# EAGLE schematic TSF (EAGLE 6.5.0)

## Sheet 1 of 2
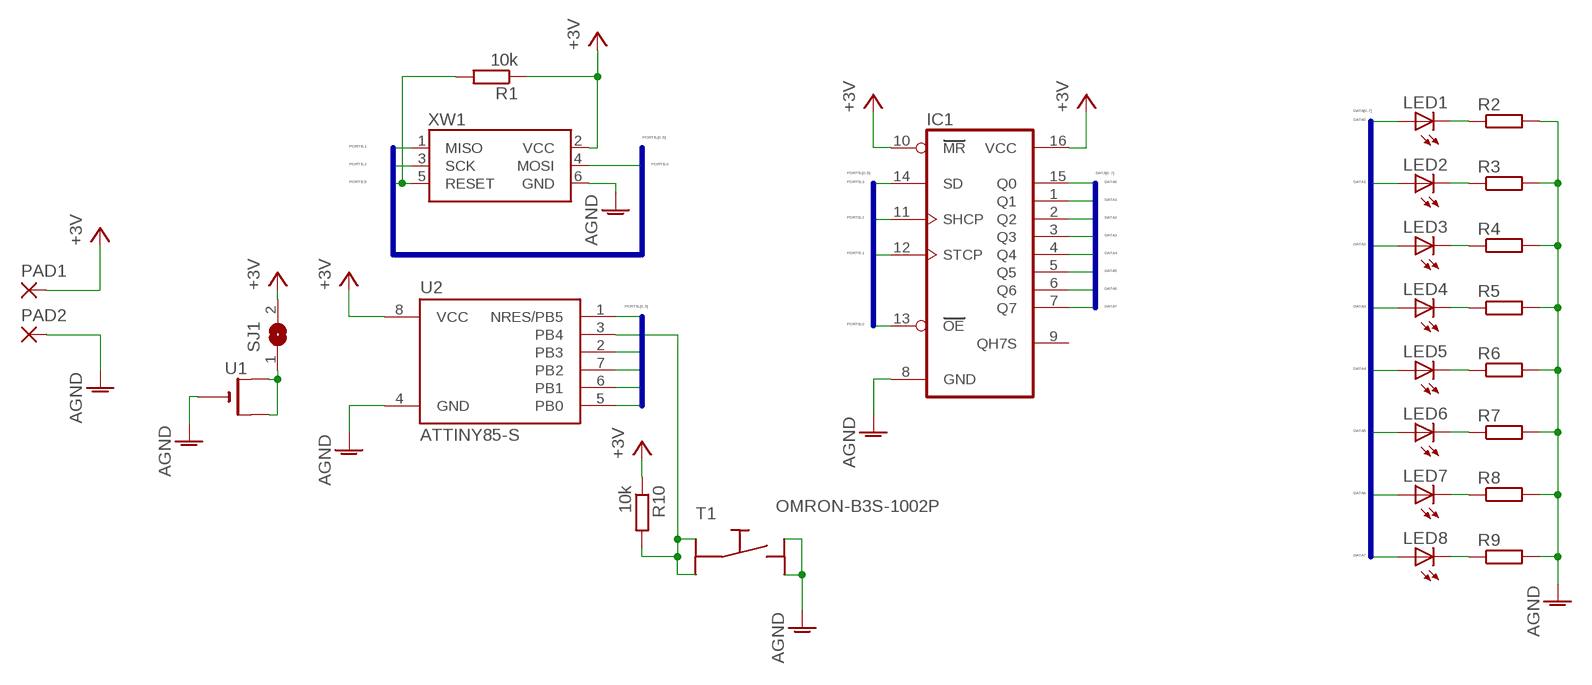
[diagram p0: schematic, sheet 1]

### Parts
IC1  74HC595D  [SO16]
LED1  LEDP-LCC-2  [P-LCC-2]
LED2  LEDP-LCC-2  [P-LCC-2]
LED3  LEDP-LCC-2  [P-LCC-2]
LED4  LEDP-LCC-2  [P-LCC-2]
LED5  LEDP-LCC-2  [P-LCC-2]
LED6  LEDP-LCC-2  [P-LCC-2]
LED7  LEDP-LCC-2  [P-LCC-2]
LED8  LEDP-LCC-2  [P-LCC-2]
PAD1  SMD2  [SMD1,27-2,54]
PAD2  SMD2  [SMD1,27-2,54]
R1  10k  R-EU_R1206  [R1206]
R2  R-EU_M1206  [M1206]
R3  R-EU_M1206  [M1206]
R4  R-EU_M1206  [M1206]
R5  R-EU_M1206  [M1206]
R6  R-EU_M1206  [M1206]
R7  R-EU_M1206  [M1206]
R8  R-EU_M1206  [M1206]
R9  R-EU_M1206  [M1206]
R10  10k  R-EU_R1206  [R1206]
SJ1  SJW  [SJW]
T1  OMRON-B3S-1002P  [B3S-1002P]
U1  CR2032SMT  [CR2032-SMD]
U2  ATTINY85-S  [SOIC8_EIAJ_208MIL]
XW1  WSLSMD  [WSL_SMD]

### Nets
AGND: IC1.8(GND) PAD2.1(P) R2.2 R3.2 R4.2 R5.2 R6.2 R7.2 R8.2 R9.2 T1.3 T1.4 U1.-
DATA0: IC1.15(Q0) LED1.A
DATA1: IC1.1(Q1) LED2.A
DATA2: IC1.2(Q2) LED3.A
DATA3: IC1.3(Q3) LED4.A
DATA4: IC1.4(Q4) LED5.A
DATA5: IC1.5(Q5) LED6.A
DATA6: IC1.6(Q6) LED7.A
DATA7: IC1.7(Q7) LED8.A
GND: XW1.6(GND) ; supply symbol labelled AGND
N$1: SJ1.1 U1.+$1(+) U1.+$2(+1)
N$6: LED1.C R2.1
N$7: LED2.C R3.1
N$8: LED3.C R4.1
N$9: LED4.C R5.1
N$10: LED5.C R6.1
N$11: LED6.C R7.1
N$12: LED7.C R8.1
N$13: LED8.C R9.1
PORTB.0: IC1.13(OE) U2.5(PB0) XW1.4(MOSI)
PORTB.1: IC1.12(STCP) U2.6(PB1) XW1.1(MISO)
PORTB.2: IC1.11(SHCP) U2.7(PB2) XW1.3(SCK)
PORTB.3: IC1.14(SD) U2.2(PB3)
PORTB.4: R10.2 T1.1 T1.2 U2.3(PB4)
PORTB.5: R1.2 U2.1(NRES/PB5) XW1.5(RESET)
VCC: IC1.10(MR) IC1.16(VCC) PAD1.1(P) R1.1 R10.1 SJ1.2 XW1.2(VCC) ; supply symbol labelled +3V
Unconnected: IC1.9(QH7S)

### Buses
PORTB.[0..5]
DATA[0..7]

## Sheet 2 of 2

## Power pins joined to a net without a drawn wire
GND: U2.4(GND)
VCC: U2.8(VCC)

## Library data of the parts
IC1 = 74_er Reihe (DIN Europa):74*595: Name des Bauteiles: 74HC595 Daten: Schieberegister 8 Bit , TTL (5V) Artikelnummer:#045077 Datenblatt:
LED1-LED8 = led:LED: LED OSRAM: - CHIPLED LG R971, LG N971, LY N971, LG Q971, LY Q971, LO R971, LY R971 LH N974, LH R974 LS Q976, LO Q976, LY Q976 LO Q996 - Hyper CHIPLED LW Q18S LB Q993, LB Q99A, LB R99A - SideLED LS A670, LO A670, LY A670, LG A670, LP A670 LB A673, LV A673, LT A673, LW A673 LH A674 LY A675 LS A676, LA A676, LO A676, LY A676, LW A676 LS A679, LY A679, LG A679 - Hyper Micro SIDELED® LS Y876, LA Y876, LO Y876, LY Y876 LT Y87S - SmartLED LW L88C, LW L88S LB L89C, LB L89S, LG L890 LS L89K, LO L89K, LY L89K LS L896, LA L896, LO L896, LY L896 - TOPLED LS T670, LO T670, LY T670, LG T670, LP T670 LSG T670, LSP T670, LSY T670, LOP T670, LYG T670 LG T671, LOG T671, LSG T671 LB T673, LV T673, LT T673, LW T673 LH T674 LS T676, LA T676, LO T676, LY T676, LB T676, LH T676, LSB T676, LW T676 LB T67C, LV T67C, LT T67C, LS T67K, LO T67K, LY T67K, LW E67C LS E67B, LA E67B, LO E67B, LY E67B, LB E67C, LV E67C, LT E67C LW T67C LS T679, LY T679, LG T679 LS T770, LO T770, LY T770, LG T770, LP T770 LB T773, LV T773, LT T773, LW T773 LH T774 LS E675, LA E675, LY E675, LS T675 LS T776, LA T776, LO T776, LY T776, LB T776 LHGB T686 LT T68C, LB T68C - Hyper Mini TOPLED® LB M676 - Mini TOPLED Santana® LG M470 LS M47K, LO M47K, LY M47K Source: http://www.osram.convergy.de LUXEON: - LUMILED® LXK2-PW12-R00, LXK2-PW12-S00, LXK2-PW14-U00, LXK2-PW14-V00 LXK2-PM12-R00, LXK2-PM12-S00, LXK2-PM14-U00 LXK2-PE12-Q00, LXK2-PE12-R00, LXK2-PE12-S00, LXK2-PE14-T00, LXK2-PE14-U00 LXK2-PB12-K00, LXK2-PB12-L00, LXK2-PB12-M00, LXK2-PB14-N00, LXK2-PB14-P00, LXK2-PB14-Q00 LXK2-PR12-L00, LXK2-PR12-M00, LXK2-PR14-Q00, LXK2-PR14-R00 LXK2-PD12-Q00, LXK2-PD12-R00, LXK2-PD12-S00 LXK2-PH12-R00, LXK2-PH12-S00 LXK2-PL12-P00, LXK2-PL12-Q00, LXK2-PL12-R00 Source: www.luxeon.com KINGBRIGHT: KA-3528ASYC Source: www.kingbright.com
PAD1 PAD2 = wirepad:SMD2: SMD PAD
R1-R10 = rcl:R-EU_: RESISTOR, European symbol
SJ1 = jumper:SJ: SMD solder JUMPER
T1 = Taster - Omron B3S-1002P:OMRON: Name des Bauteiles:SMD Taster OMRON (Omron: B3S-1002P) Daten:Waschdicht, 4 Kontakte, mineatur Taster, 6 x 6 x 4,3 mm Artikelnummer:#088017 Datenblatt:www.datasheet.com
U1 = cr2032:CR2032
U2 = _hhn_attiny25_45_85:ATTINY85*: ATMEL ATtiny 85 Packages: P = PDIP 08 30mil S = SOIC 08 EIAJ 208mil Technologies Note: for complete ordering code (temp. range, finish, tape&reel etc.) see www.atmel.com • Supply Voltage: V = (1.8…5.5)V | [blank] = (2.7…5.5)V • Speed: 10 = 10 MHz | 20 = 20 MHz Author: Dipl.-Ing. FH Rainer Bayer HHN Hochschule Heilbronn (Heilbronn University), rainer.bayer@hs-heilbronn.de Ingenieurbüro ing-rb, mail@ing-rb.de
XW1 = Atmel - ISP_6   (AVR ISP MKII):WSL: Name des Bauteiles: Wannenstecker 6 pol. Daten: 6 pol. goldene Kontakte ! Artikelnummer:#131231 Datenblatt:www.datasheet.com / www.reichelt.de